# Altium schematic sheet CAMERA_CSI_RPIv1.3.SchDoc
size A3; SheetNumber: 6; SheetTotal: 7
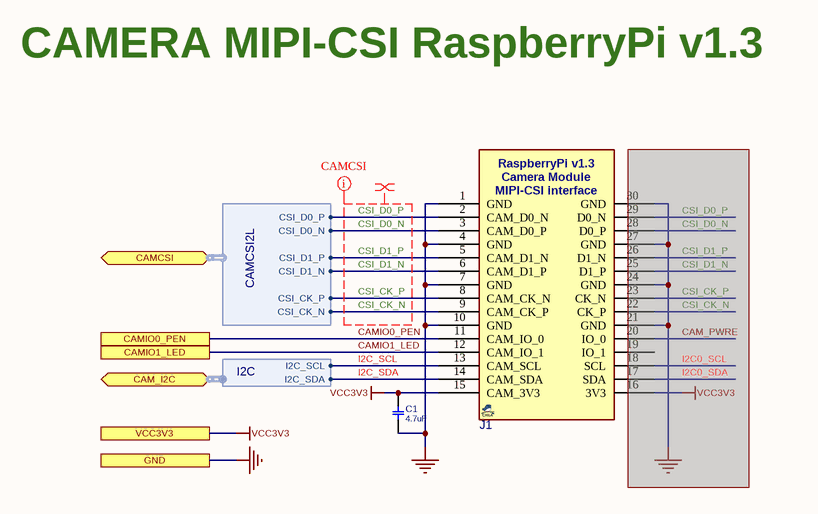
[diagram p0: CAMERA_CSI_RPIv1.3.SchDoc]

## Parts
C1  4.7uF  [C0402]
J1  RPICAM_V1.3  [FPC100_15V]  (value not drawn)

## Ports
CAM_I2C (bidir, harness I2C), CAMCSI (bidir, harness CAMCSI2L), CAMIO0_PEN, CAMIO1_LED, GND, VCC3V3

## Harnesses
CAMCSI2L: CSI_D0_P, CSI_D0_N, CSI_D1_P, CSI_D1_N, CSI_CK_P, CSI_CK_N
I2C: I2C_SCL, I2C_SDA

## Nets
GND: C1.1 J1.1(GND) J1.4(GND) J1.7(GND) J1.10(GND) ; port GND
VCC3V3: C1.2 J1.15(CAM_3V3) ; port VCC3V3
CAMIO0_PEN: J1.11(CAM_IO_0) ; port CAMIO0_PEN
CAMIO1_LED: J1.12(CAM_IO_1) ; port CAMIO1_LED
CSI_CK_N: J1.9(CAM_CK_P) ; port CAMCSI.CSI_CK_N
CSI_CK_P: J1.8(CAM_CK_N) ; port CAMCSI.CSI_CK_P
CSI_D0_N: J1.3(CAM_D0_P) ; port CAMCSI.CSI_D0_N
CSI_D0_P: J1.2(CAM_D0_N) ; port CAMCSI.CSI_D0_P
CSI_D1_N: J1.6(CAM_D1_P) ; port CAMCSI.CSI_D1_N
CSI_D1_P: J1.5(CAM_D1_N) ; port CAMCSI.CSI_D1_P
I2C_SCL: J1.13(CAM_SCL) ; port CAM_I2C.I2C_SCL
I2C_SDA: J1.14(CAM_SDA) ; port CAM_I2C.I2C_SDA

Not connected (* = marked no-connect by the designer): J1 16(3V3) 17(SDA) 18(SCL) 19(IO_1) 20(IO_0) 21(GND) 22(CK_P) 23(CK_N) 24(GND) 25(D1_P) 26(D1_N) 27(GND) 28(D0_P) 29(D0_N) 30(GND)

## Layout directives
net class CAMDVP: CSI_CK_N, CSI_CK_P, CSI_D0_N, CSI_D0_P, CSI_D1_N, CSI_D1_P
differential pair: CSI_CK_N, CSI_CK_P, CSI_D0_N, CSI_D0_P, CSI_D1_N, CSI_D1_P

## Notes on the sheet
- CAMERA MIPI-CSI RaspberryPi v1.3
- (in symbol RPICAM_V1.3_FPC15) RaspberryPi v1.3; Camera Module; MIPI-CSI interface

## Library data of the parts
C1 = CAP_SMD_MLCC: CAP, MLCC; PARAM: X5R, 20%; MANF_P#: LMK105BBJ475MVLF; MANF: Taiyo Yuden; PARAM2: 10v; PRICE: 10,000: $0.034; ASSEMBLY: ASSEMBLY; VALUE: 4.7uF
J1 = RPICAM_V1.3_FPC15: Camera Module, Color CMOS 5MP, MIPI-CSI FPC15; PARAM2: 3.3v; PARAM: RaspberryPi v1.3 camera module 5MP; VALUE: RPICAM_V1.3; MANF_P#: RPICAM_V1.3